# Altium project PCB_Project.PrjPcb
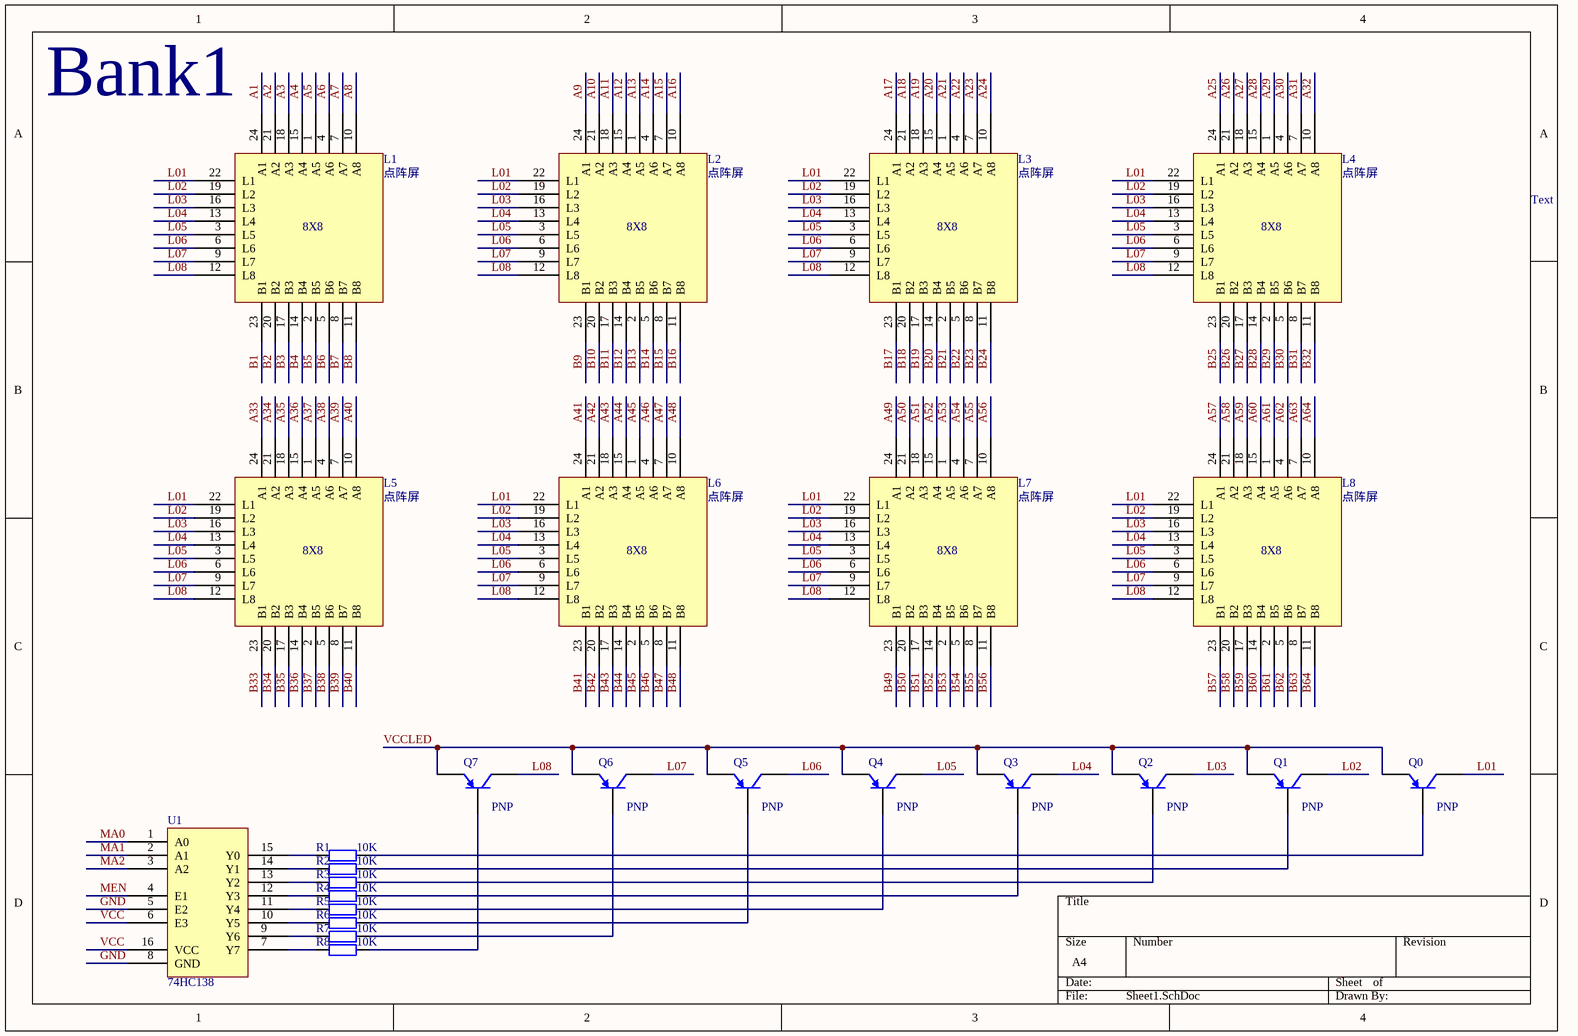
[diagram p0: Sheet1.SchDoc]
5 sheets, 54 parts. Net scope: global (net labels, ports and power ports of the same name join across sheets).
Sheets:
  Sheet1.SchDoc
  Sheet2.SchDoc
  Sheet3.SchDoc
  Sheet4.SchDoc
  Sheet5.SchDoc

## Sheet Sheet1.SchDoc
size A4

### Parts
(Parts that share a designator on the sheet are numbered #1, #2 ... from top to bottom, then left to right.)
L1  点阵屏
L2  点阵屏
L3  点阵屏
L4  点阵屏
L5  点阵屏
L6  点阵屏
L7  点阵屏
L8  点阵屏
Q0  PNP  [SOT-23B_N]
Q1  PNP  [SOT-23B_N]
Q2  PNP  [SOT-23B_N]
Q3  PNP  [SOT-23B_N]
Q4  PNP  [SOT-23B_N]
Q5  PNP  [SOT-23B_N]
Q6  PNP  [SOT-23B_N]
Q7  PNP  [SOT-23B_N]
R1  10K  [AXIAL-0.4]
R2  10K  [AXIAL-0.4]
R3  10K  [AXIAL-0.4]
R4  10K  [AXIAL-0.4]
R5  10K  [AXIAL-0.4]
R6  10K  [AXIAL-0.4]
R7  10K  [AXIAL-0.4]
R8  10K  [AXIAL-0.4]
U1#1  74HC138

### Nets
GND: U1#1.5(E2) U1#1.8(GND)
VCC: U1#1.6(E3) U1#1.16(VCC)
A1: L1.24(A1)
A2: L1.21(A2)
A3: L1.18(A3)
A4: L1.15(A4)
A5: L1.1(A5)
A6: L1.4(A6)
A7: L1.7(A7)
A8: L1.10(A8)
A9: L2.24(A1)
A10: L2.21(A2)
A11: L2.18(A3)
A12: L2.15(A4)
A13: L2.1(A5)
A14: L2.4(A6)
A15: L2.7(A7)
A16: L2.10(A8)
A17: L3.24(A1)
A18: L3.21(A2)
A19: L3.18(A3)
A20: L3.15(A4)
A21: L3.1(A5)
A22: L3.4(A6)
A23: L3.7(A7)
A24: L3.10(A8)
A25: L4.24(A1)
A26: L4.21(A2)
A27: L4.18(A3)
A28: L4.15(A4)
A29: L4.1(A5)
A30: L4.4(A6)
A31: L4.7(A7)
A32: L4.10(A8)
A33: L5.24(A1)
A34: L5.21(A2)
A35: L5.18(A3)
A36: L5.15(A4)
A37: L5.1(A5)
A38: L5.4(A6)
A39: L5.7(A7)
A40: L5.10(A8)
A41: L6.24(A1)
A42: L6.21(A2)
A43: L6.18(A3)
A44: L6.15(A4)
A45: L6.1(A5)
A46: L6.4(A6)
A47: L6.7(A7)
A48: L6.10(A8)
A49: L7.24(A1)
A50: L7.21(A2)
A51: L7.18(A3)
A52: L7.15(A4)
A53: L7.1(A5)
A54: L7.4(A6)
A55: L7.7(A7)
A56: L7.10(A8)
A57: L8.24(A1)
A58: L8.21(A2)
A59: L8.18(A3)
A60: L8.15(A4)
A61: L8.1(A5)
A62: L8.4(A6)
A63: L8.7(A7)
A64: L8.10(A8)
B1: L1.23(B1)
B2: L1.20(B2)
B3: L1.17(B3)
B4: L1.14(B4)
B5: L1.2(B5)
B6: L1.5(B6)
B7: L1.8(B7)
B8: L1.11(B8)
B9: L2.23(B1)
B10: L2.20(B2)
B11: L2.17(B3)
B12: L2.14(B4)
B13: L2.2(B5)
B14: L2.5(B6)
B15: L2.8(B7)
B16: L2.11(B8)
B17: L3.23(B1)
B18: L3.20(B2)
B19: L3.17(B3)
B20: L3.14(B4)
B21: L3.2(B5)
B22: L3.5(B6)
B23: L3.8(B7)
B24: L3.11(B8)
B25: L4.23(B1)
B26: L4.20(B2)
B27: L4.17(B3)
B28: L4.14(B4)
B29: L4.2(B5)
B30: L4.5(B6)
B31: L4.8(B7)
B32: L4.11(B8)
B33: L5.23(B1)
B34: L5.20(B2)
B35: L5.17(B3)
B36: L5.14(B4)
B37: L5.2(B5)
B38: L5.5(B6)
B39: L5.8(B7)
B40: L5.11(B8)
B41: L6.23(B1)
B42: L6.20(B2)
B43: L6.17(B3)
B44: L6.14(B4)
B45: L6.2(B5)
B46: L6.5(B6)
B47: L6.8(B7)
B48: L6.11(B8)
B49: L7.23(B1)
B50: L7.20(B2)
B51: L7.17(B3)
B52: L7.14(B4)
B53: L7.2(B5)
B54: L7.5(B6)
B55: L7.8(B7)
B56: L7.11(B8)
B57: L8.23(B1)
B58: L8.20(B2)
B59: L8.17(B3)
B60: L8.14(B4)
B61: L8.2(B5)
B62: L8.5(B6)
B63: L8.8(B7)
B64: L8.11(B8)
L01: L1.22(L1) L2.22(L1) L3.22(L1) L4.22(L1) L5.22(L1) L6.22(L1) L7.22(L1) L8.22(L1) Q0.1(C)
L02: L1.19(L2) L2.19(L2) L3.19(L2) L4.19(L2) L5.19(L2) L6.19(L2) L7.19(L2) L8.19(L2) Q1.1(C)
L03: L1.16(L3) L2.16(L3) L3.16(L3) L4.16(L3) L5.16(L3) L6.16(L3) L7.16(L3) L8.16(L3) Q2.1(C)
L04: L1.13(L4) L2.13(L4) L3.13(L4) L4.13(L4) L5.13(L4) L6.13(L4) L7.13(L4) L8.13(L4) Q3.1(C)
L05: L1.3(L5) L2.3(L5) L3.3(L5) L4.3(L5) L5.3(L5) L6.3(L5) L7.3(L5) L8.3(L5) Q4.1(C)
L06: L1.6(L6) L2.6(L6) L3.6(L6) L4.6(L6) L5.6(L6) L6.6(L6) L7.6(L6) L8.6(L6) Q5.1(C)
L07: L1.9(L7) L2.9(L7) L3.9(L7) L4.9(L7) L5.9(L7) L6.9(L7) L7.9(L7) L8.9(L7) Q6.1(C)
L08: L1.12(L8) L2.12(L8) L3.12(L8) L4.12(L8) L5.12(L8) L6.12(L8) L7.12(L8) L8.12(L8) Q7.1(C)
MA0: U1#1.1(A0)
MA1: U1#1.2(A1)
MA2: U1#1.3(A2)
MEN: U1#1.4(E1)
VCCLED: Q0.3(E) Q1.3(E) Q2.3(E) Q3.3(E) Q4.3(E) Q5.3(E) Q6.3(E) Q7.3(E)
NetQ0_2: Q0.2(B) R1.2
NetQ1_2: Q1.2(B) R2.2
NetQ2_2: Q2.2(B) R3.2
NetQ3_2: Q3.2(B) R4.2
NetQ4_2: Q4.2(B) R5.2
NetQ5_2: Q5.2(B) R6.2
NetQ6_2: Q6.2(B) R7.2
NetQ7_2: Q7.2(B) R8.2
NetR1_1: R1.1 U1#1.15(Y0)
NetR2_1: R2.1 U1#1.14(Y1)
NetR3_1: R3.1 U1#1.13(Y2)
NetR4_1: R4.1 U1#1.12(Y3)
NetR5_1: R5.1 U1#1.11(Y4)
NetR6_1: R6.1 U1#1.10(Y5)
NetR7_1: R7.1 U1#1.9(Y6)
NetR8_1: R8.1 U1#1.7(Y7)

### Notes on the sheet
- (near L1) Bank1
- Text
- (in symbol 点阵屏) 8X8

### Library data of the parts
Q0-Q7 = PNP: PNP Bipolar Transistor; Published: 8-Jun-2000; LatestRevisionDate: 29-May-2009; LatestRevisionNote: IPC-7351 Footprint Added.; PackageVersion: Aug-1999; PackageReference: SOT-23B; Publisher: Altium Limited; PackageDescription: 3-Pin SOT-23 Package 0.95 mm Pitch, 2.4 mm Lead Span
R1-R8 = Res2: Resistor; Published: 8-Jun-2000; LatestRevisionDate: 17-Jul-2002; LatestRevisionNote: Re-released for DXP Platform.; PackageReference: AXIAL-0.4; Publisher: Altium Limited; PackageDescription: Axial Device, Thru-Hole; 2 Leads; 0.4 in Pin Spacing

## Sheet Sheet2.SchDoc
size A4
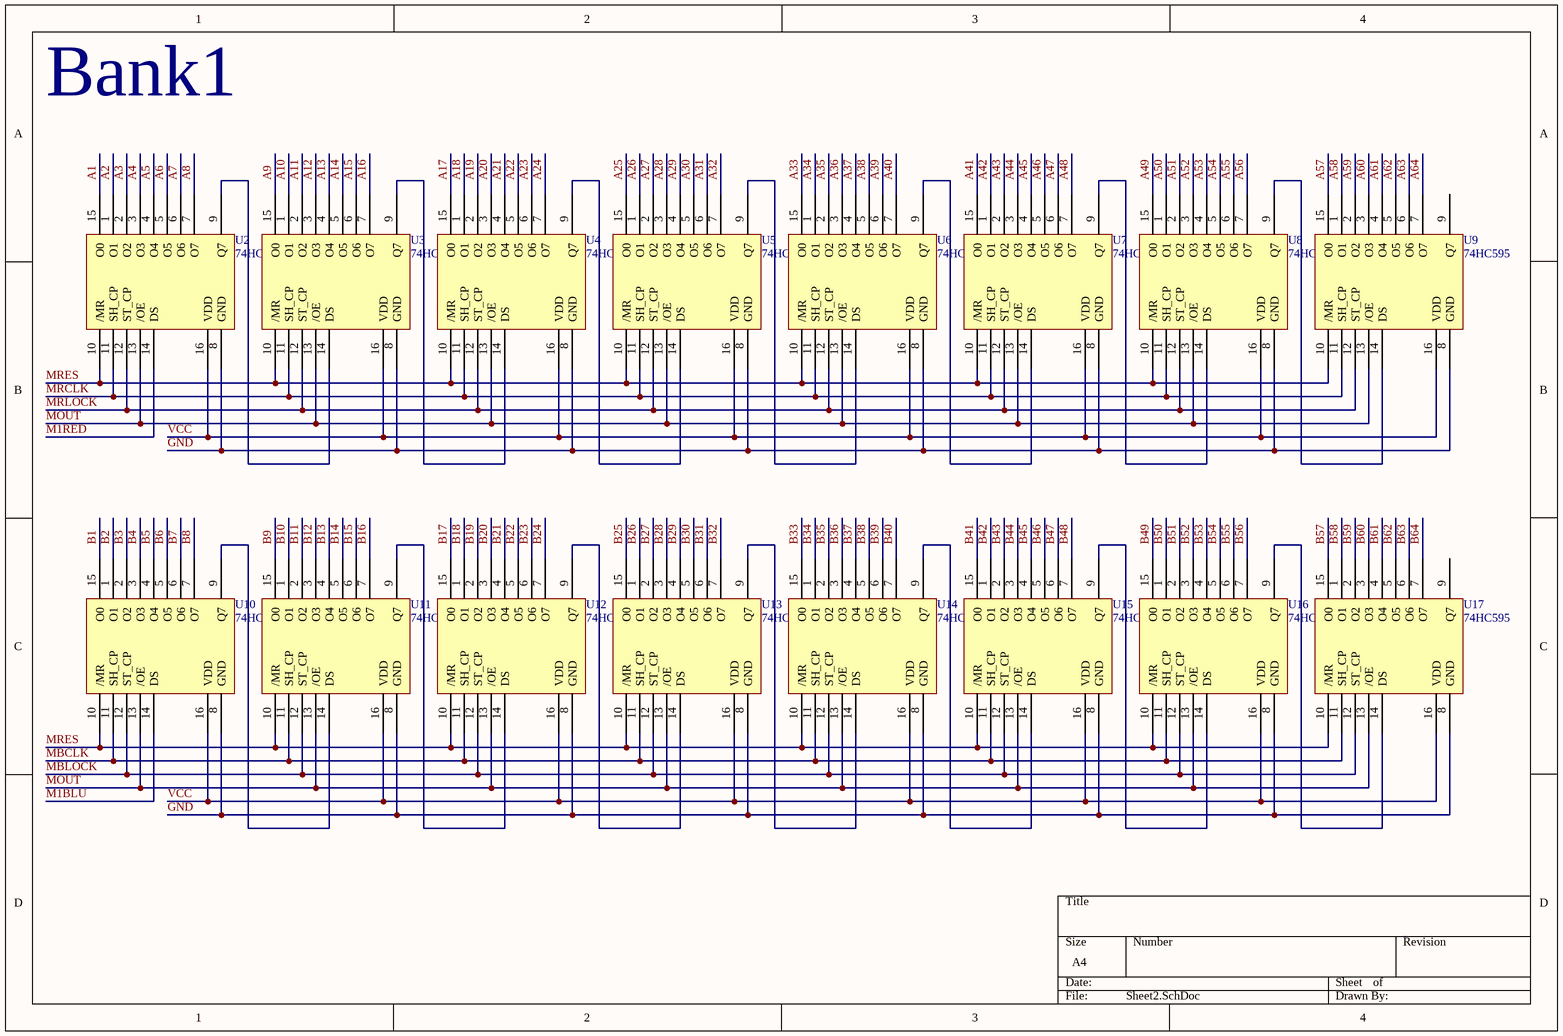
[diagram p1: Sheet2.SchDoc]

### Parts
(Parts that share a designator on the sheet are numbered #1, #2 ... from top to bottom, then left to right.)
U2#1  74HC595
U3  74HC595
U4#1  74HC595
U5#1  74HC595
U6#1  74HC595
U7#1  74HC595
U8  74HC595
U9  74HC595
U10  74HC595
U11  74HC595
U12  74HC595
U13  74HC595
U14  74HC595
U15  74HC595
U16  74HC595
U17  74HC595

### Nets
GND: U2#1.8(GND) U3.8(GND) U4#1.8(GND) U5#1.8(GND) U6#1.8(GND) U7#1.8(GND) U8.8(GND) U9.8(GND) U10.8(GND) U11.8(GND) U12.8(GND) U13.8(GND) U14.8(GND) U15.8(GND) U16.8(GND) U17.8(GND)
VCC: U2#1.16(VDD) U3.16(VDD) U4#1.16(VDD) U5#1.16(VDD) U6#1.16(VDD) U7#1.16(VDD) U8.16(VDD) U9.16(VDD) U10.16(VDD) U11.16(VDD) U12.16(VDD) U13.16(VDD) U14.16(VDD) U15.16(VDD) U16.16(VDD) U17.16(VDD)
A1: U2#1.15(O0)
A2: U2#1.1(O1)
A3: U2#1.2(O2)
A4: U2#1.3(O3)
A5: U2#1.4(O4)
A6: U2#1.5(O5)
A7: U2#1.6(O6)
A8: U2#1.7(O7)
A9: U3.15(O0)
A10: U3.1(O1)
A11: U3.2(O2)
A12: U3.3(O3)
A13: U3.4(O4)
A14: U3.5(O5)
A15: U3.6(O6)
A16: U3.7(O7)
A17: U4#1.15(O0)
A18: U4#1.1(O1)
A19: U4#1.2(O2)
A20: U4#1.3(O3)
A21: U4#1.4(O4)
A22: U4#1.5(O5)
A23: U4#1.6(O6)
A24: U4#1.7(O7)
A25: U5#1.15(O0)
A26: U5#1.1(O1)
A27: U5#1.2(O2)
A28: U5#1.3(O3)
A29: U5#1.4(O4)
A30: U5#1.5(O5)
A31: U5#1.6(O6)
A32: U5#1.7(O7)
A33: U6#1.15(O0)
A34: U6#1.1(O1)
A35: U6#1.2(O2)
A36: U6#1.3(O3)
A37: U6#1.4(O4)
A38: U6#1.5(O5)
A39: U6#1.6(O6)
A40: U6#1.7(O7)
A41: U7#1.15(O0)
A42: U7#1.1(O1)
A43: U7#1.2(O2)
A44: U7#1.3(O3)
A45: U7#1.4(O4)
A46: U7#1.5(O5)
A47: U7#1.6(O6)
A48: U7#1.7(O7)
A49: U8.15(O0)
A50: U8.1(O1)
A51: U8.2(O2)
A52: U8.3(O3)
A53: U8.4(O4)
A54: U8.5(O5)
A55: U8.6(O6)
A56: U8.7(O7)
A57: U9.15(O0)
A58: U9.1(O1)
A59: U9.2(O2)
A60: U9.3(O3)
A61: U9.4(O4)
A62: U9.5(O5)
A63: U9.6(O6)
A64: U9.7(O7)
B1: U10.15(O0)
B2: U10.1(O1)
B3: U10.2(O2)
B4: U10.3(O3)
B5: U10.4(O4)
B6: U10.5(O5)
B7: U10.6(O6)
B8: U10.7(O7)
B9: U11.15(O0)
B10: U11.1(O1)
B11: U11.2(O2)
B12: U11.3(O3)
B13: U11.4(O4)
B14: U11.5(O5)
B15: U11.6(O6)
B16: U11.7(O7)
B17: U12.15(O0)
B18: U12.1(O1)
B19: U12.2(O2)
B20: U12.3(O3)
B21: U12.4(O4)
B22: U12.5(O5)
B23: U12.6(O6)
B24: U12.7(O7)
B25: U13.15(O0)
B26: U13.1(O1)
B27: U13.2(O2)
B28: U13.3(O3)
B29: U13.4(O4)
B30: U13.5(O5)
B31: U13.6(O6)
B32: U13.7(O7)
B33: U14.15(O0)
B34: U14.1(O1)
B35: U14.2(O2)
B36: U14.3(O3)
B37: U14.4(O4)
B38: U14.5(O5)
B39: U14.6(O6)
B40: U14.7(O7)
B41: U15.15(O0)
B42: U15.1(O1)
B43: U15.2(O2)
B44: U15.3(O3)
B45: U15.4(O4)
B46: U15.5(O5)
B47: U15.6(O6)
B48: U15.7(O7)
B49: U16.15(O0)
B50: U16.1(O1)
B51: U16.2(O2)
B52: U16.3(O3)
B53: U16.4(O4)
B54: U16.5(O5)
B55: U16.6(O6)
B56: U16.7(O7)
B57: U17.15(O0)
B58: U17.1(O1)
B59: U17.2(O2)
B60: U17.3(O3)
B61: U17.4(O4)
B62: U17.5(O5)
B63: U17.6(O6)
B64: U17.7(O7)
M1BLU: U10.14(DS)
M1RED: U2#1.14(DS)
MBCLK: U10.11(SH_CP) U11.11(SH_CP) U12.11(SH_CP) U13.11(SH_CP) U14.11(SH_CP) U15.11(SH_CP) U16.11(SH_CP) U17.11(SH_CP)
MBLOCK: U10.12(ST_CP) U11.12(ST_CP) U12.12(ST_CP) U13.12(ST_CP) U14.12(ST_CP) U15.12(ST_CP) U16.12(ST_CP) U17.12(ST_CP)
MOUT: U2#1.13(/OE) U3.13(/OE) U4#1.13(/OE) U5#1.13(/OE) U6#1.13(/OE) U7#1.13(/OE) U8.13(/OE) U9.13(/OE) U10.13(/OE) U11.13(/OE) U12.13(/OE) U13.13(/OE) U14.13(/OE) U15.13(/OE) U16.13(/OE) U17.13(/OE)
MRCLK: U2#1.11(SH_CP) U3.11(SH_CP) U4#1.11(SH_CP) U5#1.11(SH_CP) U6#1.11(SH_CP) U7#1.11(SH_CP) U8.11(SH_CP) U9.11(SH_CP)
MRES: U2#1.10(/MR) U3.10(/MR) U4#1.10(/MR) U5#1.10(/MR) U6#1.10(/MR) U7#1.10(/MR) U8.10(/MR) U9.10(/MR) U10.10(/MR) U11.10(/MR) U12.10(/MR) U13.10(/MR) U14.10(/MR) U15.10(/MR) U16.10(/MR) U17.10(/MR)
MRLOCK: U2#1.12(ST_CP) U3.12(ST_CP) U4#1.12(ST_CP) U5#1.12(ST_CP) U6#1.12(ST_CP) U7#1.12(ST_CP) U8.12(ST_CP) U9.12(ST_CP)
NetU2#1_9: U2#1.9(Q7) U3.14(DS)
NetU3_9: U3.9(Q7) U4#1.14(DS)
NetU4#1_9: U4#1.9(Q7) U5#1.14(DS)
NetU5#1_9: U5#1.9(Q7) U6#1.14(DS)
NetU6#1_9: U6#1.9(Q7) U7#1.14(DS)
NetU7#1_9: U7#1.9(Q7) U8.14(DS)
NetU8_9: U8.9(Q7) U9.14(DS)
NetU10_9: U10.9(Q7) U11.14(DS)
NetU11_9: U11.9(Q7) U12.14(DS)
NetU12_9: U12.9(Q7) U13.14(DS)
NetU13_9: U13.9(Q7) U14.14(DS)
NetU14_9: U14.9(Q7) U15.14(DS)
NetU15_9: U15.9(Q7) U16.14(DS)
NetU16_9: U16.9(Q7) U17.14(DS)

Not connected (* = marked no-connect by the designer): U9 9(Q7); U17 9(Q7)

### Notes on the sheet
- Bank1

## Sheet Sheet3.SchDoc
size A4
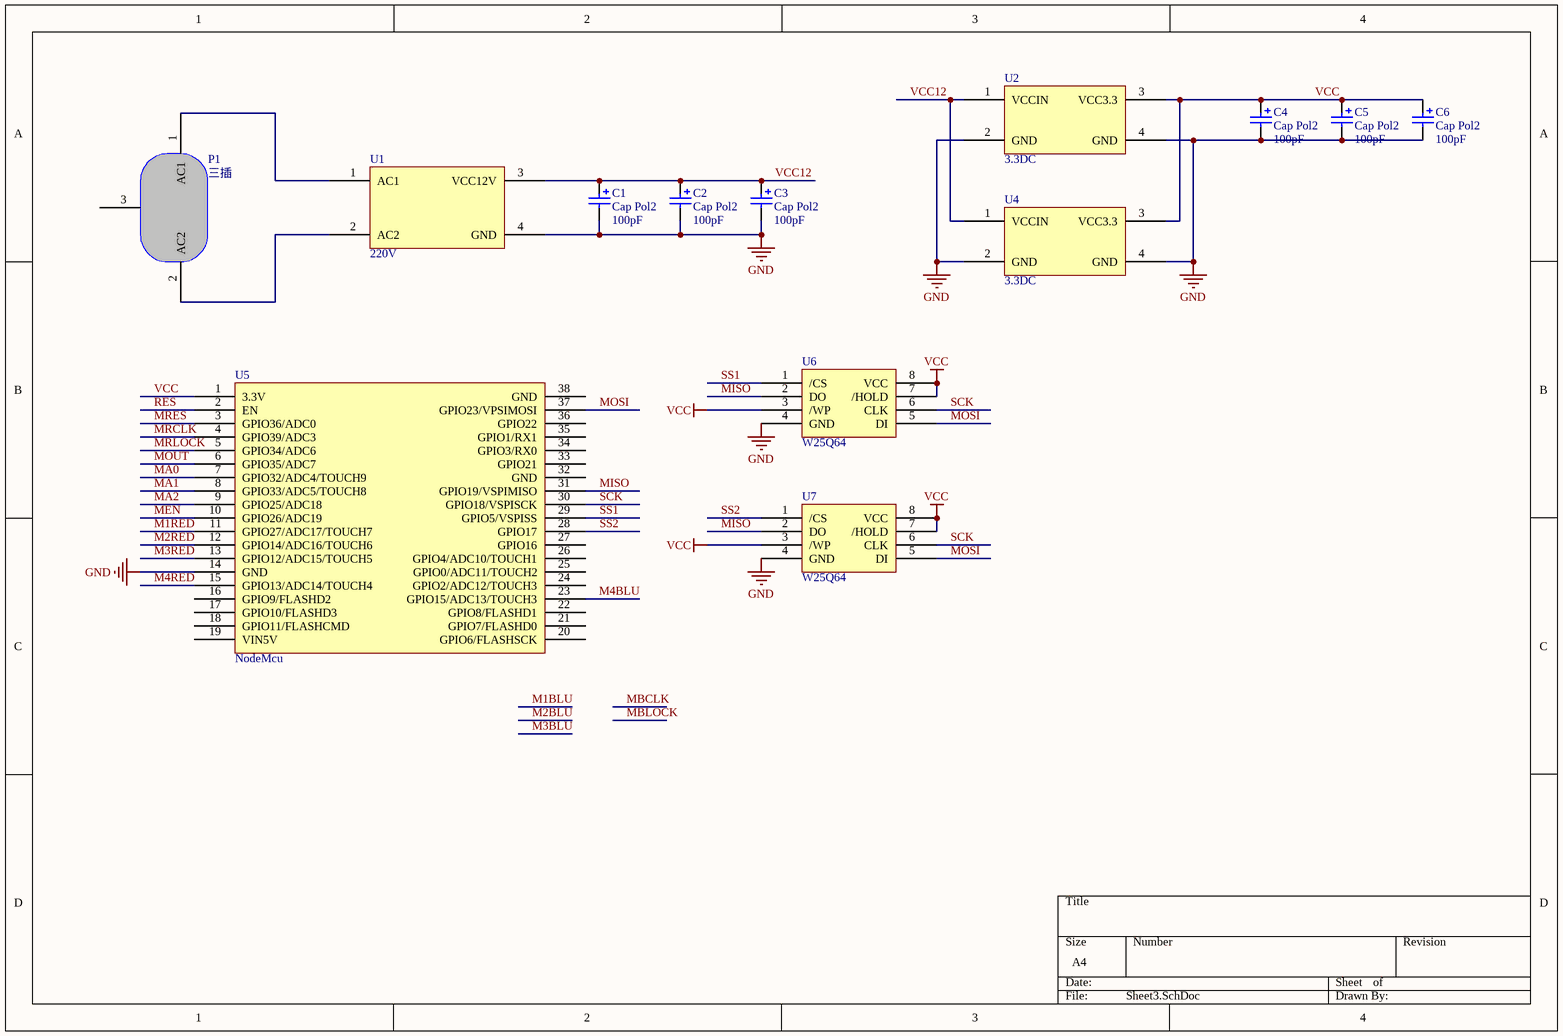
[diagram p2: Sheet3.SchDoc]

### Parts
(Parts that share a designator on the sheet are numbered #1, #2 ... from top to bottom, then left to right.)
C1  Cap Pol2  value 100pF  [POLAR0.8]
C2  Cap Pol2  value 100pF  [POLAR0.8]
C3  Cap Pol2  value 100pF  [POLAR0.8]
C4  Cap Pol2  value 100pF  [POLAR0.8]
C5  Cap Pol2  value 100pF  [POLAR0.8]
C6  Cap Pol2  value 100pF  [POLAR0.8]
P1  三插
U1#2  220V
U2#2  3.3DC
U4#2  3.3DC
U5#2  NodeMcu
U6#2  W25Q64
U7#2  W25Q64

### Nets
GND: C1.2 C2.2 C3.2 C4.2 C5.2 C6.2 U1#2.4(GND) U2#2.2(GND) U2#2.4(GND) U4#2.2(GND) U4#2.4(GND) U5#2.14(GND) U6#2.4(GND) U7#2.4(GND)
VCC: C4.1 C5.1 C6.1 U2#2.3(VCC3.3) U4#2.3(VCC3.3) U5#2.1(3.3V) U6#2.3(/WP) U6#2.7(/HOLD) U6#2.8(VCC) U7#2.3(/WP) U7#2.7(/HOLD) U7#2.8(VCC)
M1RED: U5#2.11(GPIO27/ADC17/TOUCH7)
M2RED: U5#2.12(GPIO14/ADC16/TOUCH6)
M3RED: U5#2.13(GPIO12/ADC15/TOUCH5)
M4BLU: U5#2.23(GPIO15/ADC13/TOUCH3)
M4RED: U5#2.15(GPIO13/ADC14/TOUCH4)
MA0: U5#2.7(GPIO32/ADC4/TOUCH9)
MA1: U5#2.8(GPIO33/ADC5/TOUCH8)
MA2: U5#2.9(GPIO25/ADC18)
MEN: U5#2.10(GPIO26/ADC19)
MISO: U5#2.31(GPIO19/VSPIMISO) U6#2.2(DO) U7#2.2(DO)
MOSI: U5#2.37(GPIO23/VPSIMOSI) U6#2.5(DI) U7#2.5(DI)
MOUT: U5#2.6(GPIO35/ADC7)
MRCLK: U5#2.4(GPIO39/ADC3)
MRES: U5#2.3(GPIO36/ADC0)
MRLOCK: U5#2.5(GPIO34/ADC6)
RES: U5#2.2(EN)
SCK: U5#2.30(GPIO18/VSPISCK) U6#2.6(CLK) U7#2.6(CLK)
SS1: U5#2.29(GPIO5/VSPISS) U6#2.1(/CS)
SS2: U5#2.28(GPIO17) U7#2.1(/CS)
VCC12: C1.1 C2.1 C3.1 U1#2.3(VCC12V) U2#2.1(VCCIN) U4#2.1(VCCIN)
NetP1_1: P1.1(AC1) U1#2.1(AC1)
NetP1_2: P1.2(AC2) U1#2.2(AC2)

Not connected (* = marked no-connect by the designer): P1 3; U5#2 16(GPIO9/FLASHD2) 17(GPIO10/FLASHD3) 18(GPIO11/FLASHCMD) 19(VIN5V) 20(GPIO6/FLASHSCK) 21(GPIO7/FLASHD0) 22(GPIO8/FLASHD1) 24(GPIO2/ADC12/TOUCH3) 25(GPIO0/ADC11/TOUCH2) 26(GPIO4/ADC10/TOUCH1) 27(GPIO16) 32(GND) 33(GPIO21) 34(GPIO3/RX0) 35(GPIO1/RX1) 36(GPIO22) 38(GND)

### Library data of the parts
P1 = 220V
U1#2 = AC-DC
U2#2 U4#2 = DC-DC
U5#2 = ESP32S
C1-C6 = Cap Pol2: Published: 8-Jun-2000; LatestRevisionDate: 17-Jul-2002; LatestRevisionNote: Re-released for DXP Platform.; PackageReference: POLAR0.8; Publisher: Altium Limited; PackageDescription: Polarized Capacitor; 2 Leads

## Sheet Sheet4.SchDoc
size A4

## Sheet Sheet5.SchDoc
size A4

## Nets that join several sheets
GND: Sheet1 (U1#1.5 U1#1.8), Sheet2 (16 pins), Sheet3 (14 pins)
VCC: Sheet1 (U1#1.6 U1#1.16), Sheet2 (16 pins), Sheet3 (12 pins)
A1: Sheet1 (L1.24), Sheet2 (U2#1.15)
A2: Sheet1 (L1.21), Sheet2 (U2#1.1)
A3: Sheet1 (L1.18), Sheet2 (U2#1.2)
A4: Sheet1 (L1.15), Sheet2 (U2#1.3)
A5: Sheet1 (L1.1), Sheet2 (U2#1.4)
A6: Sheet1 (L1.4), Sheet2 (U2#1.5)
A7: Sheet1 (L1.7), Sheet2 (U2#1.6)
A8: Sheet1 (L1.10), Sheet2 (U2#1.7)
A9: Sheet1 (L2.24), Sheet2 (U3.15)
A10: Sheet1 (L2.21), Sheet2 (U3.1)
A11: Sheet1 (L2.18), Sheet2 (U3.2)
A12: Sheet1 (L2.15), Sheet2 (U3.3)
A13: Sheet1 (L2.1), Sheet2 (U3.4)
A14: Sheet1 (L2.4), Sheet2 (U3.5)
A15: Sheet1 (L2.7), Sheet2 (U3.6)
A16: Sheet1 (L2.10), Sheet2 (U3.7)
A17: Sheet1 (L3.24), Sheet2 (U4#1.15)
A18: Sheet1 (L3.21), Sheet2 (U4#1.1)
A19: Sheet1 (L3.18), Sheet2 (U4#1.2)
A20: Sheet1 (L3.15), Sheet2 (U4#1.3)
A21: Sheet1 (L3.1), Sheet2 (U4#1.4)
A22: Sheet1 (L3.4), Sheet2 (U4#1.5)
A23: Sheet1 (L3.7), Sheet2 (U4#1.6)
A24: Sheet1 (L3.10), Sheet2 (U4#1.7)
A25: Sheet1 (L4.24), Sheet2 (U5#1.15)
A26: Sheet1 (L4.21), Sheet2 (U5#1.1)
A27: Sheet1 (L4.18), Sheet2 (U5#1.2)
A28: Sheet1 (L4.15), Sheet2 (U5#1.3)
A29: Sheet1 (L4.1), Sheet2 (U5#1.4)
A30: Sheet1 (L4.4), Sheet2 (U5#1.5)
A31: Sheet1 (L4.7), Sheet2 (U5#1.6)
A32: Sheet1 (L4.10), Sheet2 (U5#1.7)
A33: Sheet1 (L5.24), Sheet2 (U6#1.15)
A34: Sheet1 (L5.21), Sheet2 (U6#1.1)
A35: Sheet1 (L5.18), Sheet2 (U6#1.2)
A36: Sheet1 (L5.15), Sheet2 (U6#1.3)
A37: Sheet1 (L5.1), Sheet2 (U6#1.4)
A38: Sheet1 (L5.4), Sheet2 (U6#1.5)
A39: Sheet1 (L5.7), Sheet2 (U6#1.6)
A40: Sheet1 (L5.10), Sheet2 (U6#1.7)
A41: Sheet1 (L6.24), Sheet2 (U7#1.15)
A42: Sheet1 (L6.21), Sheet2 (U7#1.1)
A43: Sheet1 (L6.18), Sheet2 (U7#1.2)
A44: Sheet1 (L6.15), Sheet2 (U7#1.3)
A45: Sheet1 (L6.1), Sheet2 (U7#1.4)
A46: Sheet1 (L6.4), Sheet2 (U7#1.5)
A47: Sheet1 (L6.7), Sheet2 (U7#1.6)
A48: Sheet1 (L6.10), Sheet2 (U7#1.7)
A49: Sheet1 (L7.24), Sheet2 (U8.15)
A50: Sheet1 (L7.21), Sheet2 (U8.1)
A51: Sheet1 (L7.18), Sheet2 (U8.2)
A52: Sheet1 (L7.15), Sheet2 (U8.3)
A53: Sheet1 (L7.1), Sheet2 (U8.4)
A54: Sheet1 (L7.4), Sheet2 (U8.5)
A55: Sheet1 (L7.7), Sheet2 (U8.6)
A56: Sheet1 (L7.10), Sheet2 (U8.7)
A57: Sheet1 (L8.24), Sheet2 (U9.15)
A58: Sheet1 (L8.21), Sheet2 (U9.1)
A59: Sheet1 (L8.18), Sheet2 (U9.2)
A60: Sheet1 (L8.15), Sheet2 (U9.3)
A61: Sheet1 (L8.1), Sheet2 (U9.4)
A62: Sheet1 (L8.4), Sheet2 (U9.5)
A63: Sheet1 (L8.7), Sheet2 (U9.6)
A64: Sheet1 (L8.10), Sheet2 (U9.7)
B1: Sheet1 (L1.23), Sheet2 (U10.15)
B2: Sheet1 (L1.20), Sheet2 (U10.1)
B3: Sheet1 (L1.17), Sheet2 (U10.2)
B4: Sheet1 (L1.14), Sheet2 (U10.3)
B5: Sheet1 (L1.2), Sheet2 (U10.4)
B6: Sheet1 (L1.5), Sheet2 (U10.5)
B7: Sheet1 (L1.8), Sheet2 (U10.6)
B8: Sheet1 (L1.11), Sheet2 (U10.7)
B9: Sheet1 (L2.23), Sheet2 (U11.15)
B10: Sheet1 (L2.20), Sheet2 (U11.1)
B11: Sheet1 (L2.17), Sheet2 (U11.2)
B12: Sheet1 (L2.14), Sheet2 (U11.3)
B13: Sheet1 (L2.2), Sheet2 (U11.4)
B14: Sheet1 (L2.5), Sheet2 (U11.5)
B15: Sheet1 (L2.8), Sheet2 (U11.6)
B16: Sheet1 (L2.11), Sheet2 (U11.7)
B17: Sheet1 (L3.23), Sheet2 (U12.15)
B18: Sheet1 (L3.20), Sheet2 (U12.1)
B19: Sheet1 (L3.17), Sheet2 (U12.2)
B20: Sheet1 (L3.14), Sheet2 (U12.3)
B21: Sheet1 (L3.2), Sheet2 (U12.4)
B22: Sheet1 (L3.5), Sheet2 (U12.5)
B23: Sheet1 (L3.8), Sheet2 (U12.6)
B24: Sheet1 (L3.11), Sheet2 (U12.7)
B25: Sheet1 (L4.23), Sheet2 (U13.15)
B26: Sheet1 (L4.20), Sheet2 (U13.1)
B27: Sheet1 (L4.17), Sheet2 (U13.2)
B28: Sheet1 (L4.14), Sheet2 (U13.3)
B29: Sheet1 (L4.2), Sheet2 (U13.4)
B30: Sheet1 (L4.5), Sheet2 (U13.5)
B31: Sheet1 (L4.8), Sheet2 (U13.6)
B32: Sheet1 (L4.11), Sheet2 (U13.7)
B33: Sheet1 (L5.23), Sheet2 (U14.15)
B34: Sheet1 (L5.20), Sheet2 (U14.1)
B35: Sheet1 (L5.17), Sheet2 (U14.2)
B36: Sheet1 (L5.14), Sheet2 (U14.3)
B37: Sheet1 (L5.2), Sheet2 (U14.4)
B38: Sheet1 (L5.5), Sheet2 (U14.5)
B39: Sheet1 (L5.8), Sheet2 (U14.6)
B40: Sheet1 (L5.11), Sheet2 (U14.7)
B41: Sheet1 (L6.23), Sheet2 (U15.15)
B42: Sheet1 (L6.20), Sheet2 (U15.1)
B43: Sheet1 (L6.17), Sheet2 (U15.2)
B44: Sheet1 (L6.14), Sheet2 (U15.3)
B45: Sheet1 (L6.2), Sheet2 (U15.4)
B46: Sheet1 (L6.5), Sheet2 (U15.5)
B47: Sheet1 (L6.8), Sheet2 (U15.6)
B48: Sheet1 (L6.11), Sheet2 (U15.7)
B49: Sheet1 (L7.23), Sheet2 (U16.15)
B50: Sheet1 (L7.20), Sheet2 (U16.1)
B51: Sheet1 (L7.17), Sheet2 (U16.2)
B52: Sheet1 (L7.14), Sheet2 (U16.3)
B53: Sheet1 (L7.2), Sheet2 (U16.4)
B54: Sheet1 (L7.5), Sheet2 (U16.5)
B55: Sheet1 (L7.8), Sheet2 (U16.6)
B56: Sheet1 (L7.11), Sheet2 (U16.7)
B57: Sheet1 (L8.23), Sheet2 (U17.15)
B58: Sheet1 (L8.20), Sheet2 (U17.1)
B59: Sheet1 (L8.17), Sheet2 (U17.2)
B60: Sheet1 (L8.14), Sheet2 (U17.3)
B61: Sheet1 (L8.2), Sheet2 (U17.4)
B62: Sheet1 (L8.5), Sheet2 (U17.5)
B63: Sheet1 (L8.8), Sheet2 (U17.6)
B64: Sheet1 (L8.11), Sheet2 (U17.7)
M1RED: Sheet2 (U2#1.14), Sheet3 (U5#2.11)
MA0: Sheet1 (U1#1.1), Sheet3 (U5#2.7)
MA1: Sheet1 (U1#1.2), Sheet3 (U5#2.8)
MA2: Sheet1 (U1#1.3), Sheet3 (U5#2.9)
MEN: Sheet1 (U1#1.4), Sheet3 (U5#2.10)
MOUT: Sheet2 (16 pins), Sheet3 (U5#2.6)
MRCLK: Sheet2 (8 pins), Sheet3 (U5#2.4)
MRES: Sheet2 (16 pins), Sheet3 (U5#2.3)
MRLOCK: Sheet2 (8 pins), Sheet3 (U5#2.5)